# Altium project ElectricalConductivityMeter.PrjPcb
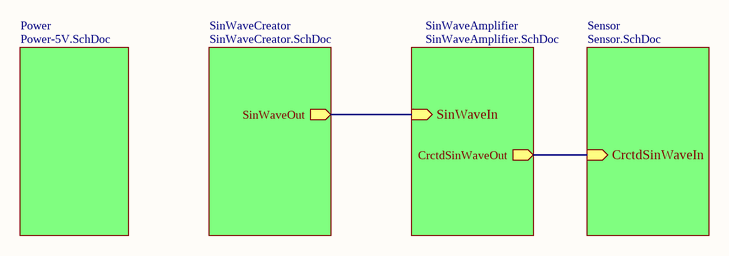
[diagram p0: TopLayer.SchDoc]
5 sheets, 67 parts. Net scope: hierarchical (ports join the sheet entries above them; power ports are global).
Board file: ElectricalConductivityMeter.PcbDoc
Sheets:
  TopLayer.SchDoc
    SinWaveCreator = SinWaveCreator.SchDoc
    SinWaveAmplifier = SinWaveAmplifier.SchDoc
    Sensor = Sensor.SchDoc
    Power = Power-5V.SchDoc

## Sheet TopLayer.SchDoc
size A4

### Sub-sheets
Power = Power-5V.SchDoc: no entries
Sensor = Sensor.SchDoc: CrctdSinWaveIn (in)
SinWaveAmplifier = SinWaveAmplifier.SchDoc: SinWaveIn (in), CrctdSinWaveOut (out)
SinWaveCreator = SinWaveCreator.SchDoc: SinWaveOut (out)

### Nets
AmpSinWave: sheet SinWaveAmplifier/CrctdSinWaveOut, sheet Sensor/CrctdSinWaveIn
SinWave: sheet SinWaveCreator/SinWaveOut, sheet SinWaveAmplifier/SinWaveIn

### Notes on the sheet
- 图纸大小
- 文件名：
- A4
- 版本号
- 1.0
- 创建日期
- 单位
- 2019/11/28
- HFUT
- 修改日期
- 作者
- XuPeng

## Sheet SinWaveCreator.SchDoc
size A4
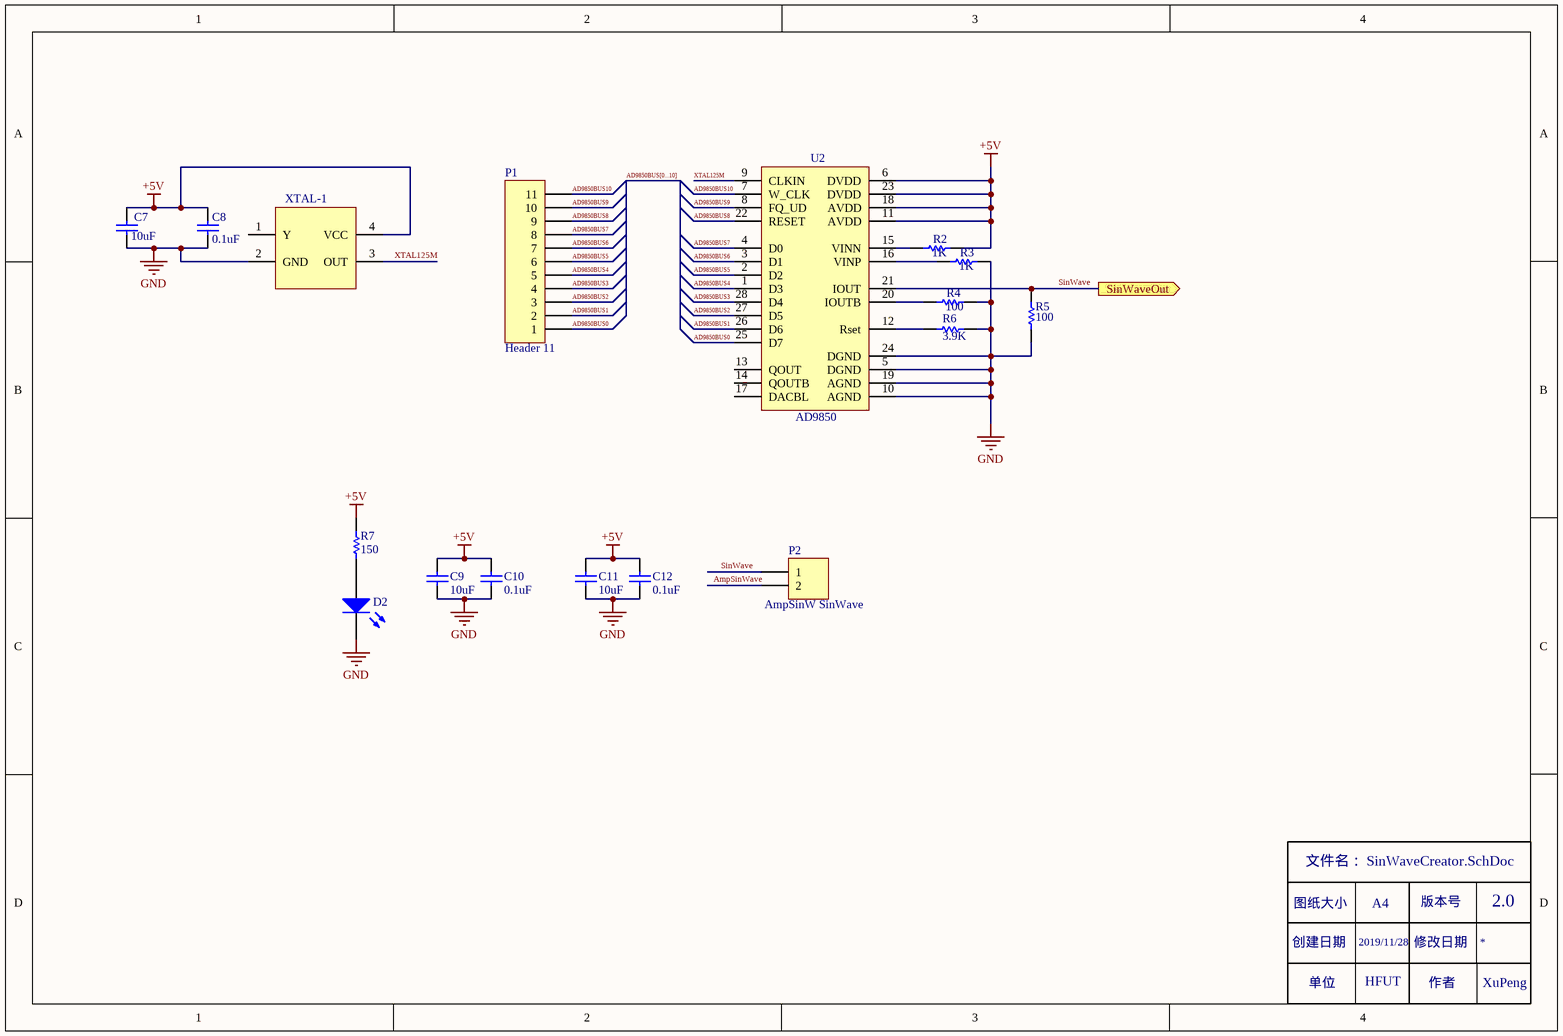
[diagram p1: SinWaveCreator.SchDoc]

### Parts
C7  value 10uF  [RB0.1/0.2]  (hidden comment: Cap)
C8  value 0.1uF  [C-RAD]  (hidden comment: Cap)
C9  value 10uF  [RB0.1/0.2]  (hidden comment: Cap)
C10  value 0.1uF  [C-RAD]  (hidden comment: Cap)
C11  value 10uF  [RB0.1/0.2]  (hidden comment: Cap)
C12  value 0.1uF  [C-RAD]  (hidden comment: Cap)
D2  LED0  [RB2.54/4]  (value not drawn)
P1  Header 11  [HDR1X11]
P2  AmpSinW SinWave  [HDR1X2]
R2  value 1K  [AXIAL-0.3]  (hidden comment: Res1)
R3  value 1K  [AXIAL-0.3]  (hidden comment: Res1)
R4  value 100  [AXIAL-0.3]  (hidden comment: Res1)
R5  value 100  [AXIAL-0.3]  (hidden comment: Res1)
R6  value 3.9K  [AXIAL-0.3]  (hidden comment: Res1)
R7  value 150  [AXIAL-0.3]  (hidden comment: Res1)
U2  AD9850  [SSOP28]
XTAL-1  XTAL-125M-7.62  [XTAL-4-7.62]  (value not drawn)

### Ports
SinWaveOut (out)

### Nets
+5V: C7.2 C8.2 C9.2 C10.2 C11.2 C12.2 R2.2 R7.2 U2.6(DVDD) U2.11(AVDD) U2.18(AVDD) U2.23(DVDD) XTAL-1.4(VCC)
GND: C7.1 C8.1 C9.1 C10.1 C11.1 C12.1 D2.2(K) R3.2 R4.2 R5.1 R6.2 U2.5(DGND) U2.10(AGND) U2.19(AGND) U2.24(DGND) XTAL-1.2(GND)
AD9850BUS0: P1.1 U2.25(D7)
AD9850BUS1: P1.2 U2.26(D6)
AD9850BUS2: P1.3 U2.27(D5)
AD9850BUS3: P1.4 U2.28(D4)
AD9850BUS4: P1.5 U2.1(D3)
AD9850BUS5: P1.6 U2.2(D2)
AD9850BUS6: P1.7 U2.3(D1)
AD9850BUS7: P1.8 U2.4(D0)
AD9850BUS8: P1.9 U2.22(RESET)
AD9850BUS9: P1.10 U2.8(FQ_UD)
AD9850BUS10: P1.11 U2.7(W_CLK)
AmpSinWave: P2.2
SinWave: P2.1 R5.2 U2.21(IOUT) ; port SinWaveOut
XTAL125M: U2.9(CLKIN) XTAL-1.3(OUT)
NetD2_1: D2.1(A) R7.1
NetR2_1: R2.1 U2.15(VINN)
NetR3_1: R3.1 U2.16(VINP)
NetR4_1: R4.1 U2.20(IOUTB)
NetR6_1: R6.1 U2.12(Rset)

Not connected (* = marked no-connect by the designer): U2 13(QOUT) 14(QOUTB) 17(DACBL); XTAL-1 1(Y)

### Buses and harness runs
bus AD9850BUS[0...10]

### Notes on the sheet
- 2.0
- 图纸大小
- 文件名：
- A4
- 版本号
- 创建日期
- 单位
- 2019/11/28
- HFUT
- 修改日期
- 作者
- XuPeng

### Library data of the parts
C7-C12 = Cap: 无极性电容; Published: 8-Jun-2000; PackageReference: RAD-0.3; Publisher: Altium Limited; LatestRevisionDate: 17-Jul-2002; LatestRevisionNote: Re-released for DXP Platform.
D2 = LED0: Typical INFRARED GaAs LED; Published: 8-Jun-2000; LatestRevisionDate: 08-Jul-2005; LatestRevisionNote: Mech Layer 1 removed.; PackageReference: LED-0; Publisher: Altium Limited; PackageDescription: LED; 2 Leads
P1 = Header 11: Header, 11-Pin; LatestRevisionDate: 17-Jul-2002; LatestRevisionNote: Re-released for DXP Platform.; Publisher: Altium Limited
P2 = Header 2: Header, 2-Pin; LatestRevisionDate: 17-Jul-2002; LatestRevisionNote: Re-released for DXP Platform.; Publisher: Altium Limited
R2-R7 = Res1: Resistor; Published: 8-Jun-2000; LatestRevisionDate: 17-Jul-2002; LatestRevisionNote: Re-released for DXP Platform.; PackageReference: AXIAL-0.3; Publisher: Altium Limited; PackageDescription: Axial Device, Thru-Hole; 2 Leads; 0.3 in Pin Spacing

## Sheet SinWaveAmplifier.SchDoc
size A4
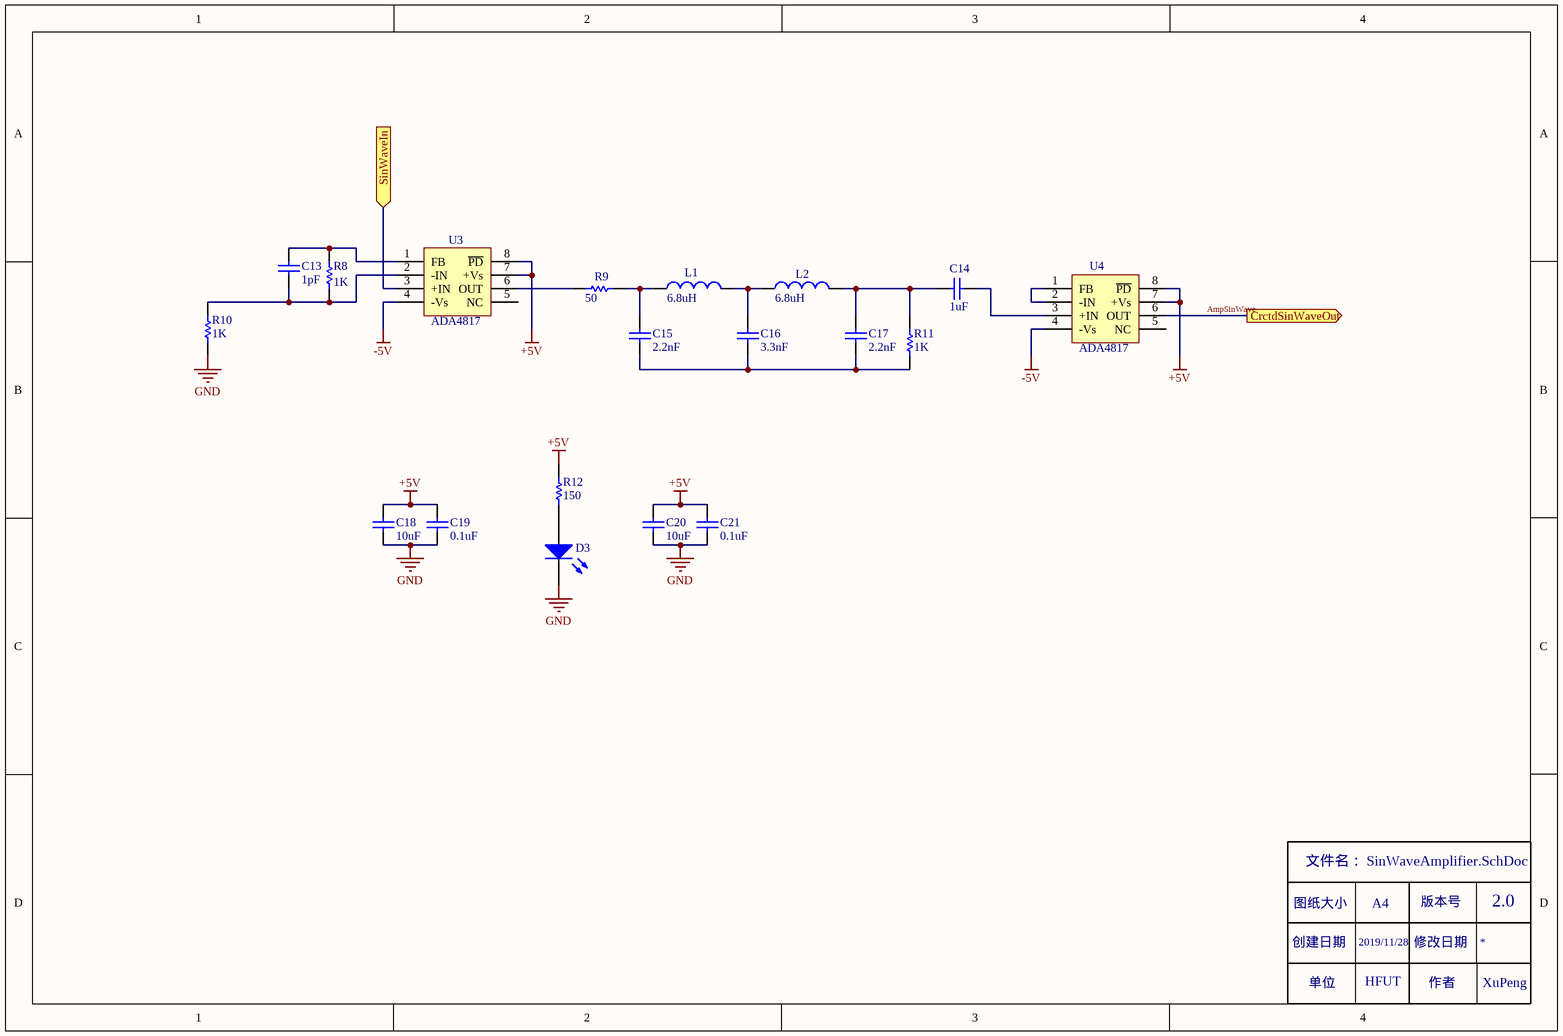
[diagram p2: SinWaveAmplifier.SchDoc]

### Parts
C13  value 1pF  [C-RAD]  (hidden comment: Cap)
C14  value 1uF  [C-RAD]  (hidden comment: Cap)
C15  value 2.2nF  [C-RAD]  (hidden comment: Cap)
C16  value 3.3nF  [C-RAD]  (hidden comment: Cap)
C17  value 2.2nF  [C-RAD]  (hidden comment: Cap)
C18  value 10uF  [RB0.1/0.2]  (hidden comment: Cap)
C19  value 0.1uF  [C-RAD]  (hidden comment: Cap)
C20  value 10uF  [RB0.1/0.2]  (hidden comment: Cap)
C21  value 0.1uF  [C-RAD]  (hidden comment: Cap)
D3  LED0  [RB2.54/4]  (value not drawn)
L1  value 6.8uH  [PK0608-2.8/7]  (hidden comment: Inductor)
L2  value 6.8uH  [PK0608-2.8/7]  (hidden comment: Inductor)
R8  value 1K  [AXIAL-0.3]  (hidden comment: Res1)
R9  value 50  [AXIAL-0.3]  (hidden comment: Res1)
R10  value 1K  [AXIAL-0.3]  (hidden comment: Res1)
R11  value 1K  [AXIAL-0.3]  (hidden comment: Res1)
R12  value 150  [AXIAL-0.3]  (hidden comment: Res1)
U3  ADA4817  [SOP8]
U4  ADA4817  [SOP8]

### Ports
CrctdSinWaveOut (out), SinWaveIn (in)

### Nets
+5V: C18.2 C19.2 C20.2 C21.2 R12.2 U3.7(+Vs) U3.8(~{PD}) U4.7(+Vs) U4.8(~{PD})
-5V: U3.4(-Vs) U4.4(-Vs)
GND: C18.1 C19.1 C20.1 C21.1 D3.2(K) R10.1
AmpSinWave: U4.6(OUT) ; port CrctdSinWaveOut
SinWave: U3.3(+IN) ; port SinWaveIn
NetC13_1: C13.1 R8.1 R10.2 U3.2(-IN)
NetC13_2: C13.2 R8.2 U3.1(FB)
NetC14_1: C14.1 C17.2 L2.2 R11.2
NetC14_2: C14.2 U4.3(+IN)
NetC15_1: C15.1 C16.1 C17.1 R11.1
NetC15_2: C15.2 L1.1 R9.2
NetC16_2: C16.2 L1.2 L2.1
NetD3_1: D3.1(A) R12.1
NetR9_1: R9.1 U3.6(OUT)
NetU4_1: U4.1(FB) U4.2(-IN)

Not connected (* = marked no-connect by the designer): U3 5(NC); U4 5(NC)

### Notes on the sheet
- 2.0
- 图纸大小
- 文件名：
- A4
- 版本号
- 创建日期
- 单位
- 2019/11/28
- HFUT
- 修改日期
- 作者
- XuPeng

### Library data of the parts
C13-C21 = Cap: 无极性电容; Published: 8-Jun-2000; PackageReference: RAD-0.3; Publisher: Altium Limited; LatestRevisionDate: 17-Jul-2002; LatestRevisionNote: Re-released for DXP Platform.
D3 = LED0: Typical INFRARED GaAs LED; Published: 8-Jun-2000; LatestRevisionDate: 08-Jul-2005; LatestRevisionNote: Mech Layer 1 removed.; PackageReference: LED-0; Publisher: Altium Limited; PackageDescription: LED; 2 Leads
L1 L2 = Inductor: Code_IEC: 1005; Published: 8-Jun-2000; LatestRevisionDate: 29-May-2009; LatestRevisionNote: IPC-7351 Footprint Added.; PackageReference: 0402-A; Publisher: Altium Limited; PackageDescription: Chip Inductor; Code_JEITA: 0402
R8-R12 = Res1: Resistor; Published: 8-Jun-2000; LatestRevisionDate: 17-Jul-2002; LatestRevisionNote: Re-released for DXP Platform.; PackageReference: AXIAL-0.3; Publisher: Altium Limited; PackageDescription: Axial Device, Thru-Hole; 2 Leads; 0.3 in Pin Spacing

## Sheet Sensor.SchDoc
size A4
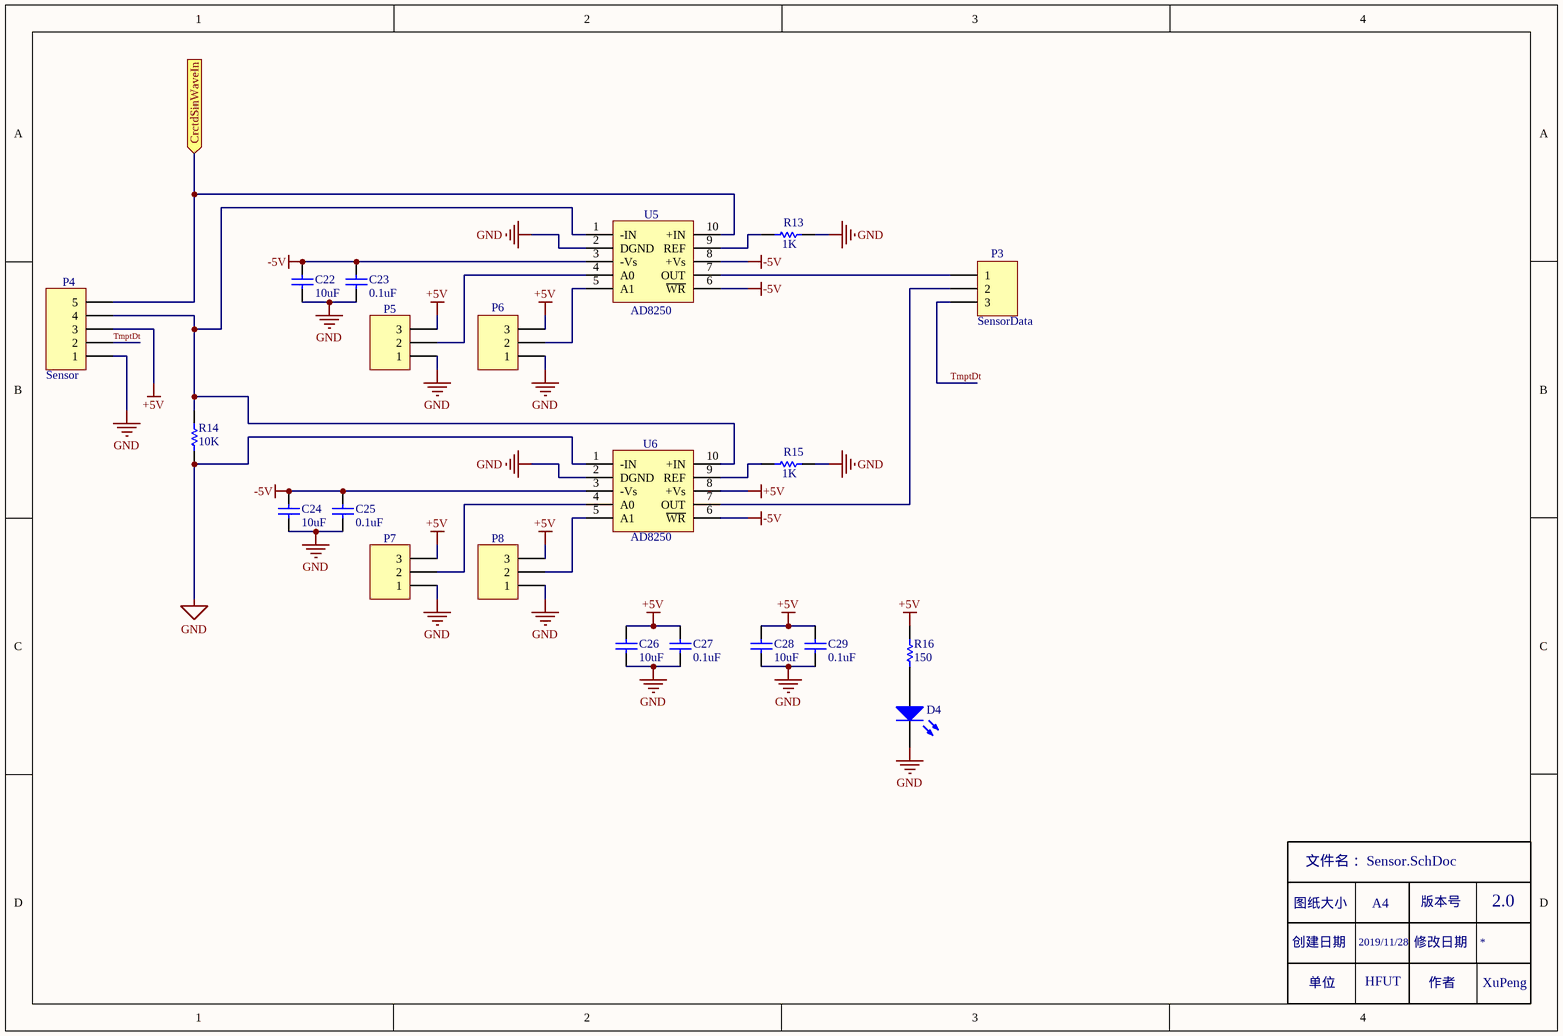
[diagram p3: Sensor.SchDoc]

### Parts
C22  value 10uF  [RB0.1/0.2]  (hidden comment: Cap)
C23  value 0.1uF  [C-RAD]  (hidden comment: Cap)
C24  value 10uF  [RB0.1/0.2]  (hidden comment: Cap)
C25  value 0.1uF  [C-RAD]  (hidden comment: Cap)
C26  value 10uF  [RB0.1/0.2]  (hidden comment: Cap)
C27  value 0.1uF  [C-RAD]  (hidden comment: Cap)
C28  value 10uF  [RB0.1/0.2]  (hidden comment: Cap)
C29  value 0.1uF  [C-RAD]  (hidden comment: Cap)
D4  LED0  [RB2.54/4]  (value not drawn)
P3  SensorData  [HDR1X3]
P4  Sensor  [HDR1X5]
P5  Header 3  [HDR1X3]  (value not drawn)
P6  Header 3  [HDR1X3]  (value not drawn)
P7  Header 3  [HDR1X3]  (value not drawn)
P8  Header 3  [HDR1X3]  (value not drawn)
R13  value 1K  [AXIAL-0.3]  (hidden comment: Res1)
R14  value 10K  [AXIAL-0.3]  (hidden comment: Res1)
R15  value 1K  [AXIAL-0.3]  (hidden comment: Res1)
R16  value 150  [AXIAL-0.3]  (hidden comment: Res1)
U5  AD8250  [MSOP10]
U6  AD8250  [MSOP10]

### Ports
CrctdSinWaveIn (in)

### Nets
+5V: C26.2 C27.2 C28.2 C29.2 P4.3 P5.3 P6.3 P7.3 P8.3 R16.2 U6.8(+Vs)
-5V: C22.2 C23.2 C24.2 C25.2 U5.3(-Vs) U5.6(~{WR}) U5.8(+Vs) U6.3(-Vs) U6.6(~{WR})
GND: C22.1 C23.1 C24.1 C25.1 C26.1 C27.1 C28.1 C29.1 D4.2(K) P4.1 P5.1 P6.1 P7.1 P8.1 R13.2 R14.1 R15.2 U5.2(DGND) U6.1(-IN) U6.2(DGND)
AmpSinWave: P4.5 U5.10(+IN) ; port CrctdSinWaveIn
TmptDt: P3.3 P4.2
NetD4_1: D4.1(A) R16.1
NetP3_1: P3.1 U5.7(OUT)
NetP3_2: P3.2 U6.7(OUT)
NetP4_4: P4.4 R14.2 U5.1(-IN) U6.10(+IN)
NetP5_2: P5.2 U5.4(A0)
NetP6_2: P6.2 U5.5(A1)
NetP7_2: P7.2 U6.4(A0)
NetP8_2: P8.2 U6.5(A1)
NetR13_1: R13.1 U5.9(REF)
NetR15_1: R15.1 U6.9(REF)

### Notes on the sheet
- 2.0
- 图纸大小
- 文件名：
- A4
- 版本号
- 创建日期
- 单位
- 2019/11/28
- HFUT
- 修改日期
- 作者
- XuPeng

### Library data of the parts
C22-C29 = Cap: 无极性电容; Published: 8-Jun-2000; PackageReference: RAD-0.3; Publisher: Altium Limited; LatestRevisionDate: 17-Jul-2002; LatestRevisionNote: Re-released for DXP Platform.
D4 = LED0: Typical INFRARED GaAs LED; Published: 8-Jun-2000; LatestRevisionDate: 08-Jul-2005; LatestRevisionNote: Mech Layer 1 removed.; PackageReference: LED-0; Publisher: Altium Limited; PackageDescription: LED; 2 Leads
P3 P5-P8 = Header 3: Header, 3-Pin; LatestRevisionDate: 17-Jul-2002; LatestRevisionNote: Re-released for DXP Platform.; Publisher: Altium Limited
P4 = Header 5: Header, 5-Pin; LatestRevisionDate: 17-Jul-2002; LatestRevisionNote: Re-released for DXP Platform.; Publisher: Altium Limited
R13-R16 = Res1: Resistor; Published: 8-Jun-2000; LatestRevisionDate: 17-Jul-2002; LatestRevisionNote: Re-released for DXP Platform.; PackageReference: AXIAL-0.3; Publisher: Altium Limited; PackageDescription: Axial Device, Thru-Hole; 2 Leads; 0.3 in Pin Spacing

## Sheet Power-5V.SchDoc
size A4
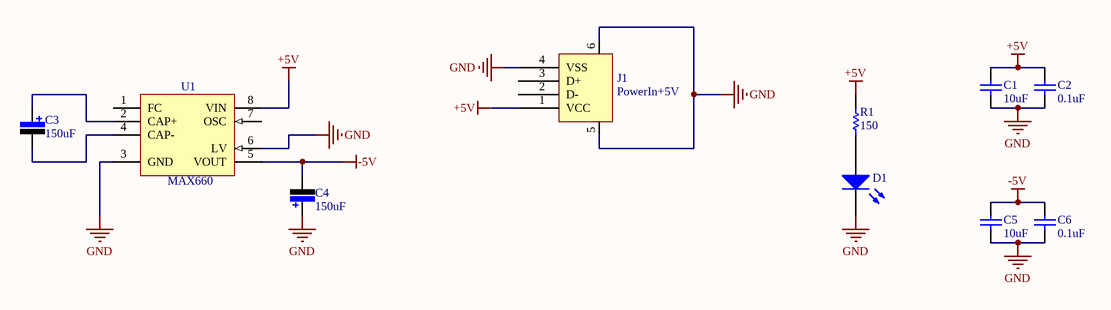
[diagram p4: Power-5V.SchDoc]

### Parts
C1  value 10uF  [RB0.1/0.2]  (hidden comment: Cap)
C2  value 0.1uF  [C-RAD]  (hidden comment: Cap)
C3  value 150uF  [RB0.15/3]  (hidden comment: Cap Pol)
C4  value 150uF  [RB0.15/3]  (hidden comment: Cap Pol)
C5  value 10uF  [RB0.1/0.2]  (hidden comment: Cap)
C6  value 0.1uF  [C-RAD]  (hidden comment: Cap)
D1  LED0  [RB2.54/4]  (value not drawn)
J1  PowerIn+5V  [USB_A1]
R1  value 150  [AXIAL-0.3]  (hidden comment: Res1)
U1  MAX660  [DIP-8]

### Nets
+5V: C1.2 C2.2 J1.1(VCC) R1.2 U1.8(VIN)
-5V: C4.2 C5.2 C6.2 U1.5(VOUT)
GND: C1.1 C2.1 C4.1 C5.1 C6.1 D1.2(K) J1.4(VSS) J1.5 J1.6 U1.3(GND) U1.6(LV)
NetC3_1: C3.1 U1.2(CAP+)
NetC3_2: C3.2 U1.4(CAP-)
NetD1_1: D1.1(A) R1.1

Not connected (* = marked no-connect by the designer): J1 2(D-) 3(D+); U1 1(FC) 7(OSC)

### Notes on the sheet
- 图纸大小
- 文件名：
- A4
- 版本号
- 创建日期
- 单位
- 2019/11/28
- HFUT
- 修改日期
- 作者
- XuPeng

### Library data of the parts
C1 C2 C5 C6 = Cap: 无极性电容; Published: 8-Jun-2000; PackageReference: RAD-0.3; Publisher: Altium Limited; LatestRevisionDate: 17-Jul-2002; LatestRevisionNote: Re-released for DXP Platform.
C3 C4 = Cap Pol: 极性电解电容; Vol: 16V; Published: 8-Jun-2000; LatestRevisionDate: 17-Jul-2002; LatestRevisionNote: Re-released for DXP Platform.; PackageReference: RB7.6-15; Publisher: Altium Limited
D1 = LED0: Typical INFRARED GaAs LED; Published: 8-Jun-2000; LatestRevisionDate: 08-Jul-2005; LatestRevisionNote: Mech Layer 1 removed.; PackageReference: LED-0; Publisher: Altium Limited; PackageDescription: LED; 2 Leads
J1 = USB: USB接口
R1 = Res1: Resistor; Published: 8-Jun-2000; LatestRevisionDate: 17-Jul-2002; LatestRevisionNote: Re-released for DXP Platform.; PackageReference: AXIAL-0.3; Publisher: Altium Limited; PackageDescription: Axial Device, Thru-Hole; 2 Leads; 0.3 in Pin Spacing
U1 = MAX660CSA: -5V电源芯片; Published: 16-Jan-2001; LatestRevisionDate: 13-Apr-2006; LatestRevisionNote: IPC-7351 Footprint Added.; DatasheetVersion: Sep-1996; PackageReference: NSO8; Publisher: Altium Limited; PackageDescription: 8-Pin Small Outline Integrated Circuit 1.27 mm Pitch; Code_JEDEC: MS-012-AA; Code_IPC: SOIC127P600-8; ComponentLink1Description: Manufacturer Link; ComponentLink1URL: http://www.maxim-ic.com/; ComponentLink2Description: Datasheet; ComponentLink2URL: http://pdfserv.maxim-ic.com/en/ds/MAX660.pdf

## Nets that join several sheets
+5V: SinWaveCreator (13 pins), SinWaveAmplifier (9 pins), Sensor (11 pins), Power-5V (5 pins)
-5V: SinWaveAmplifier (U3.4 U4.4), Sensor (9 pins), Power-5V (C4.2 C5.2 C6.2 U1.5)
GND: SinWaveCreator (16 pins), SinWaveAmplifier (6 pins), Sensor (20 pins), Power-5V (11 pins)
AmpSinWave: SinWaveAmplifier (U4.6), Sensor (P4.5 U5.10)
SinWave: SinWaveCreator (P2.1 R5.2 U2.21), SinWaveAmplifier (U3.3)